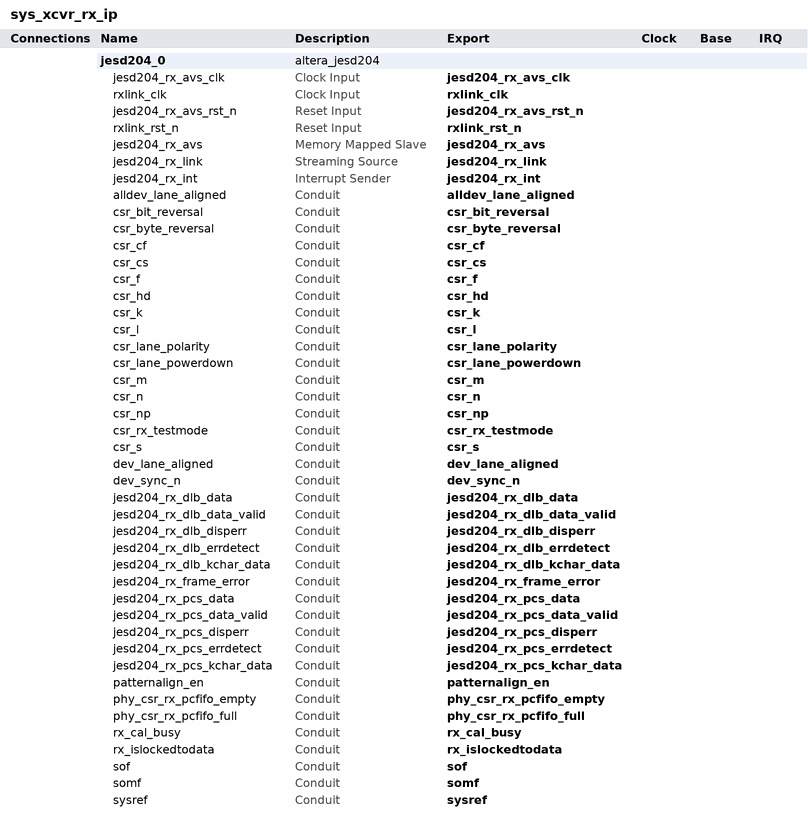
[diagram p0: system contents]
# Platform Designer (Qsys) system sys_xcvr_rx_ip, Arria 10 10AX115S3F45I2SGE2
# Parameters at their usual value, and those the tool derives, are not listed.
package require -exact qsys 15.0
create_system sys_xcvr_rx_ip
set_project_property DEVICE_FAMILY {Arria 10}
set_project_property DEVICE 10AX115S3F45I2SGE2

add_instance jesd204_0 altera_jesd204 15.0
set_instance_property jesd204_0 AUTO_EXPORT true
set_instance_parameter_value jesd204_0 ADJCNT 0
set_instance_parameter_value jesd204_0 ADJDIR 0
set_instance_parameter_value jesd204_0 BID 0
set_instance_parameter_value jesd204_0 CF 0
set_instance_parameter_value jesd204_0 CS 0
set_instance_parameter_value jesd204_0 DATA_PATH RX
set_instance_parameter_value jesd204_0 DID 0
set_instance_parameter_value jesd204_0 DLB_TEST 0
set_instance_parameter_value jesd204_0 ECC_EN 0
set_instance_parameter_value jesd204_0 GUI_CFG_F 1
set_instance_parameter_value jesd204_0 GUI_EN_CFG_F true
set_instance_parameter_value jesd204_0 HD 1
set_instance_parameter_value jesd204_0 JESDV 1
set_instance_parameter_value jesd204_0 K 32
set_instance_parameter_value jesd204_0 L 4
set_instance_parameter_value jesd204_0 LID0 0
set_instance_parameter_value jesd204_0 LID1 1
set_instance_parameter_value jesd204_0 LID2 2
set_instance_parameter_value jesd204_0 LID3 3
set_instance_parameter_value jesd204_0 LID4 4
set_instance_parameter_value jesd204_0 LID5 5
set_instance_parameter_value jesd204_0 LID6 6
set_instance_parameter_value jesd204_0 LID7 7
set_instance_parameter_value jesd204_0 M 2
set_instance_parameter_value jesd204_0 N 16
set_instance_parameter_value jesd204_0 N_PRIME 16
set_instance_parameter_value jesd204_0 OPTIMIZE 0
set_instance_parameter_value jesd204_0 PCS_CONFIG JESD_PCS_CFG1
set_instance_parameter_value jesd204_0 PHADJ 0
set_instance_parameter_value jesd204_0 REFCLK_FREQ 125.0
set_instance_parameter_value jesd204_0 RES1 0
set_instance_parameter_value jesd204_0 RES2 0
set_instance_parameter_value jesd204_0 S 1
set_instance_parameter_value jesd204_0 SCR 1
set_instance_parameter_value jesd204_0 SUBCLASSV 1
set_instance_parameter_value jesd204_0 TERMINATE_RECONFIG_EN false
set_instance_parameter_value jesd204_0 TEST_COMPONENTS_EN false
set_instance_parameter_value jesd204_0 bitrev_en false
set_instance_parameter_value jesd204_0 bonded_mode bonded
set_instance_parameter_value jesd204_0 lane_rate 10000.0
set_instance_parameter_value jesd204_0 part_trait_bd NIGHTFURY5ES2
set_instance_parameter_value jesd204_0 part_trait_dp 10AX115S3F45I2SGE2
set_instance_parameter_value jesd204_0 pll_reconfig_enable false
set_instance_parameter_value jesd204_0 pll_type CMU
set_instance_parameter_value jesd204_0 rcfg_jtag_enable false
set_instance_parameter_value jesd204_0 sdc_constraint 1.0
set_instance_parameter_value jesd204_0 set_capability_reg_enable false
set_instance_parameter_value jesd204_0 set_csr_soft_logic_enable false
set_instance_parameter_value jesd204_0 set_prbs_soft_logic_enable false
set_instance_parameter_value jesd204_0 set_user_identifier 0
set_instance_parameter_value jesd204_0 wrapper_opt base

# exported interfaces
add_interface alldev_lane_aligned conduit end
set_interface_property alldev_lane_aligned EXPORT_OF jesd204_0.alldev_lane_aligned
add_interface csr_bit_reversal conduit end
set_interface_property csr_bit_reversal EXPORT_OF jesd204_0.csr_bit_reversal
add_interface csr_byte_reversal conduit end
set_interface_property csr_byte_reversal EXPORT_OF jesd204_0.csr_byte_reversal
add_interface csr_cf conduit end
set_interface_property csr_cf EXPORT_OF jesd204_0.csr_cf
add_interface csr_cs conduit end
set_interface_property csr_cs EXPORT_OF jesd204_0.csr_cs
add_interface csr_f conduit end
set_interface_property csr_f EXPORT_OF jesd204_0.csr_f
add_interface csr_hd conduit end
set_interface_property csr_hd EXPORT_OF jesd204_0.csr_hd
add_interface csr_k conduit end
set_interface_property csr_k EXPORT_OF jesd204_0.csr_k
add_interface csr_l conduit end
set_interface_property csr_l EXPORT_OF jesd204_0.csr_l
add_interface csr_lane_polarity conduit end
set_interface_property csr_lane_polarity EXPORT_OF jesd204_0.csr_lane_polarity
add_interface csr_lane_powerdown conduit end
set_interface_property csr_lane_powerdown EXPORT_OF jesd204_0.csr_lane_powerdown
add_interface csr_m conduit end
set_interface_property csr_m EXPORT_OF jesd204_0.csr_m
add_interface csr_n conduit end
set_interface_property csr_n EXPORT_OF jesd204_0.csr_n
add_interface csr_np conduit end
set_interface_property csr_np EXPORT_OF jesd204_0.csr_np
add_interface csr_rx_testmode conduit end
set_interface_property csr_rx_testmode EXPORT_OF jesd204_0.csr_rx_testmode
add_interface csr_s conduit end
set_interface_property csr_s EXPORT_OF jesd204_0.csr_s
add_interface dev_lane_aligned conduit end
set_interface_property dev_lane_aligned EXPORT_OF jesd204_0.dev_lane_aligned
add_interface dev_sync_n conduit end
set_interface_property dev_sync_n EXPORT_OF jesd204_0.dev_sync_n
add_interface jesd204_rx_avs avalon slave
set_interface_property jesd204_rx_avs EXPORT_OF jesd204_0.jesd204_rx_avs
add_interface jesd204_rx_avs_clk clock sink
set_interface_property jesd204_rx_avs_clk EXPORT_OF jesd204_0.jesd204_rx_avs_clk
add_interface jesd204_rx_avs_rst_n reset sink
set_interface_property jesd204_rx_avs_rst_n EXPORT_OF jesd204_0.jesd204_rx_avs_rst_n
add_interface jesd204_rx_dlb_data conduit end
set_interface_property jesd204_rx_dlb_data EXPORT_OF jesd204_0.jesd204_rx_dlb_data
add_interface jesd204_rx_dlb_data_valid conduit end
set_interface_property jesd204_rx_dlb_data_valid EXPORT_OF jesd204_0.jesd204_rx_dlb_data_valid
add_interface jesd204_rx_dlb_disperr conduit end
set_interface_property jesd204_rx_dlb_disperr EXPORT_OF jesd204_0.jesd204_rx_dlb_disperr
add_interface jesd204_rx_dlb_errdetect conduit end
set_interface_property jesd204_rx_dlb_errdetect EXPORT_OF jesd204_0.jesd204_rx_dlb_errdetect
add_interface jesd204_rx_dlb_kchar_data conduit end
set_interface_property jesd204_rx_dlb_kchar_data EXPORT_OF jesd204_0.jesd204_rx_dlb_kchar_data
add_interface jesd204_rx_frame_error conduit end
set_interface_property jesd204_rx_frame_error EXPORT_OF jesd204_0.jesd204_rx_frame_error
add_interface jesd204_rx_int interrupt sender
set_interface_property jesd204_rx_int EXPORT_OF jesd204_0.jesd204_rx_int
add_interface jesd204_rx_link avalon_streaming source
set_interface_property jesd204_rx_link EXPORT_OF jesd204_0.jesd204_rx_link
add_interface jesd204_rx_pcs_data conduit end
set_interface_property jesd204_rx_pcs_data EXPORT_OF jesd204_0.jesd204_rx_pcs_data
add_interface jesd204_rx_pcs_data_valid conduit end
set_interface_property jesd204_rx_pcs_data_valid EXPORT_OF jesd204_0.jesd204_rx_pcs_data_valid
add_interface jesd204_rx_pcs_disperr conduit end
set_interface_property jesd204_rx_pcs_disperr EXPORT_OF jesd204_0.jesd204_rx_pcs_disperr
add_interface jesd204_rx_pcs_errdetect conduit end
set_interface_property jesd204_rx_pcs_errdetect EXPORT_OF jesd204_0.jesd204_rx_pcs_errdetect
add_interface jesd204_rx_pcs_kchar_data conduit end
set_interface_property jesd204_rx_pcs_kchar_data EXPORT_OF jesd204_0.jesd204_rx_pcs_kchar_data
add_interface patternalign_en conduit end
set_interface_property patternalign_en EXPORT_OF jesd204_0.patternalign_en
add_interface phy_csr_rx_pcfifo_empty conduit end
set_interface_property phy_csr_rx_pcfifo_empty EXPORT_OF jesd204_0.phy_csr_rx_pcfifo_empty
add_interface phy_csr_rx_pcfifo_full conduit end
set_interface_property phy_csr_rx_pcfifo_full EXPORT_OF jesd204_0.phy_csr_rx_pcfifo_full
add_interface rx_cal_busy conduit end
set_interface_property rx_cal_busy EXPORT_OF jesd204_0.rx_cal_busy
add_interface rx_islockedtodata conduit end
set_interface_property rx_islockedtodata EXPORT_OF jesd204_0.rx_islockedtodata
add_interface rxlink_clk clock sink
set_interface_property rxlink_clk EXPORT_OF jesd204_0.rxlink_clk
add_interface rxlink_rst_n reset sink
set_interface_property rxlink_rst_n EXPORT_OF jesd204_0.rxlink_rst_n
add_interface sof conduit end
set_interface_property sof EXPORT_OF jesd204_0.sof
add_interface somf conduit end
set_interface_property somf EXPORT_OF jesd204_0.somf
add_interface sysref conduit end
set_interface_property sysref EXPORT_OF jesd204_0.sysref

set_interconnect_requirement {$system} qsys_mm.clockCrossingAdapter HANDSHAKE
set_interconnect_requirement {$system} qsys_mm.enableEccProtection FALSE
set_interconnect_requirement {$system} qsys_mm.insertDefaultSlave FALSE
set_interconnect_requirement {$system} qsys_mm.maxAdditionalLatency 1

save_system sys_xcvr_rx_ip.qsys
